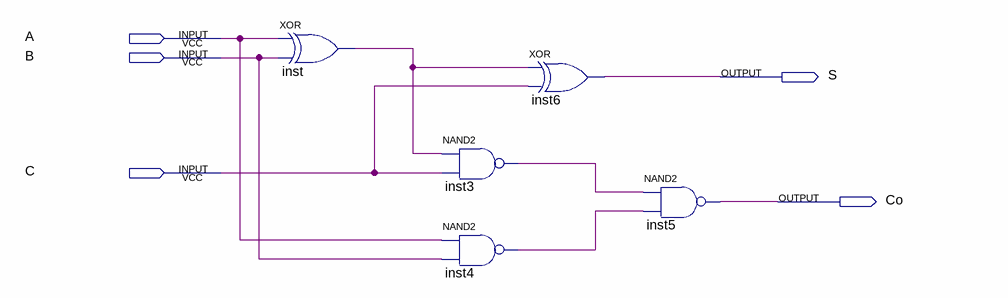
[diagram p0: schematic sheet]
// Quartus schematic Full_Adder.bdf as structural Verilog: 5 symbols, 5 pins
module Full_Adder (
  input  A,
  input  B,
  input  C,
  output S,
  output Co
);

  wire inst3_out, inst4_out, inst_out;

  xor inst (inst_out, A, B);
  nand inst3 (inst3_out, inst_out, C);
  nand inst4 (inst4_out, A, B);
  xor inst6 (S, inst_out, C);
  nand inst5 (Co, inst3_out, inst4_out);
endmodule
